# EAGLE design danger (EAGLE 6.4)
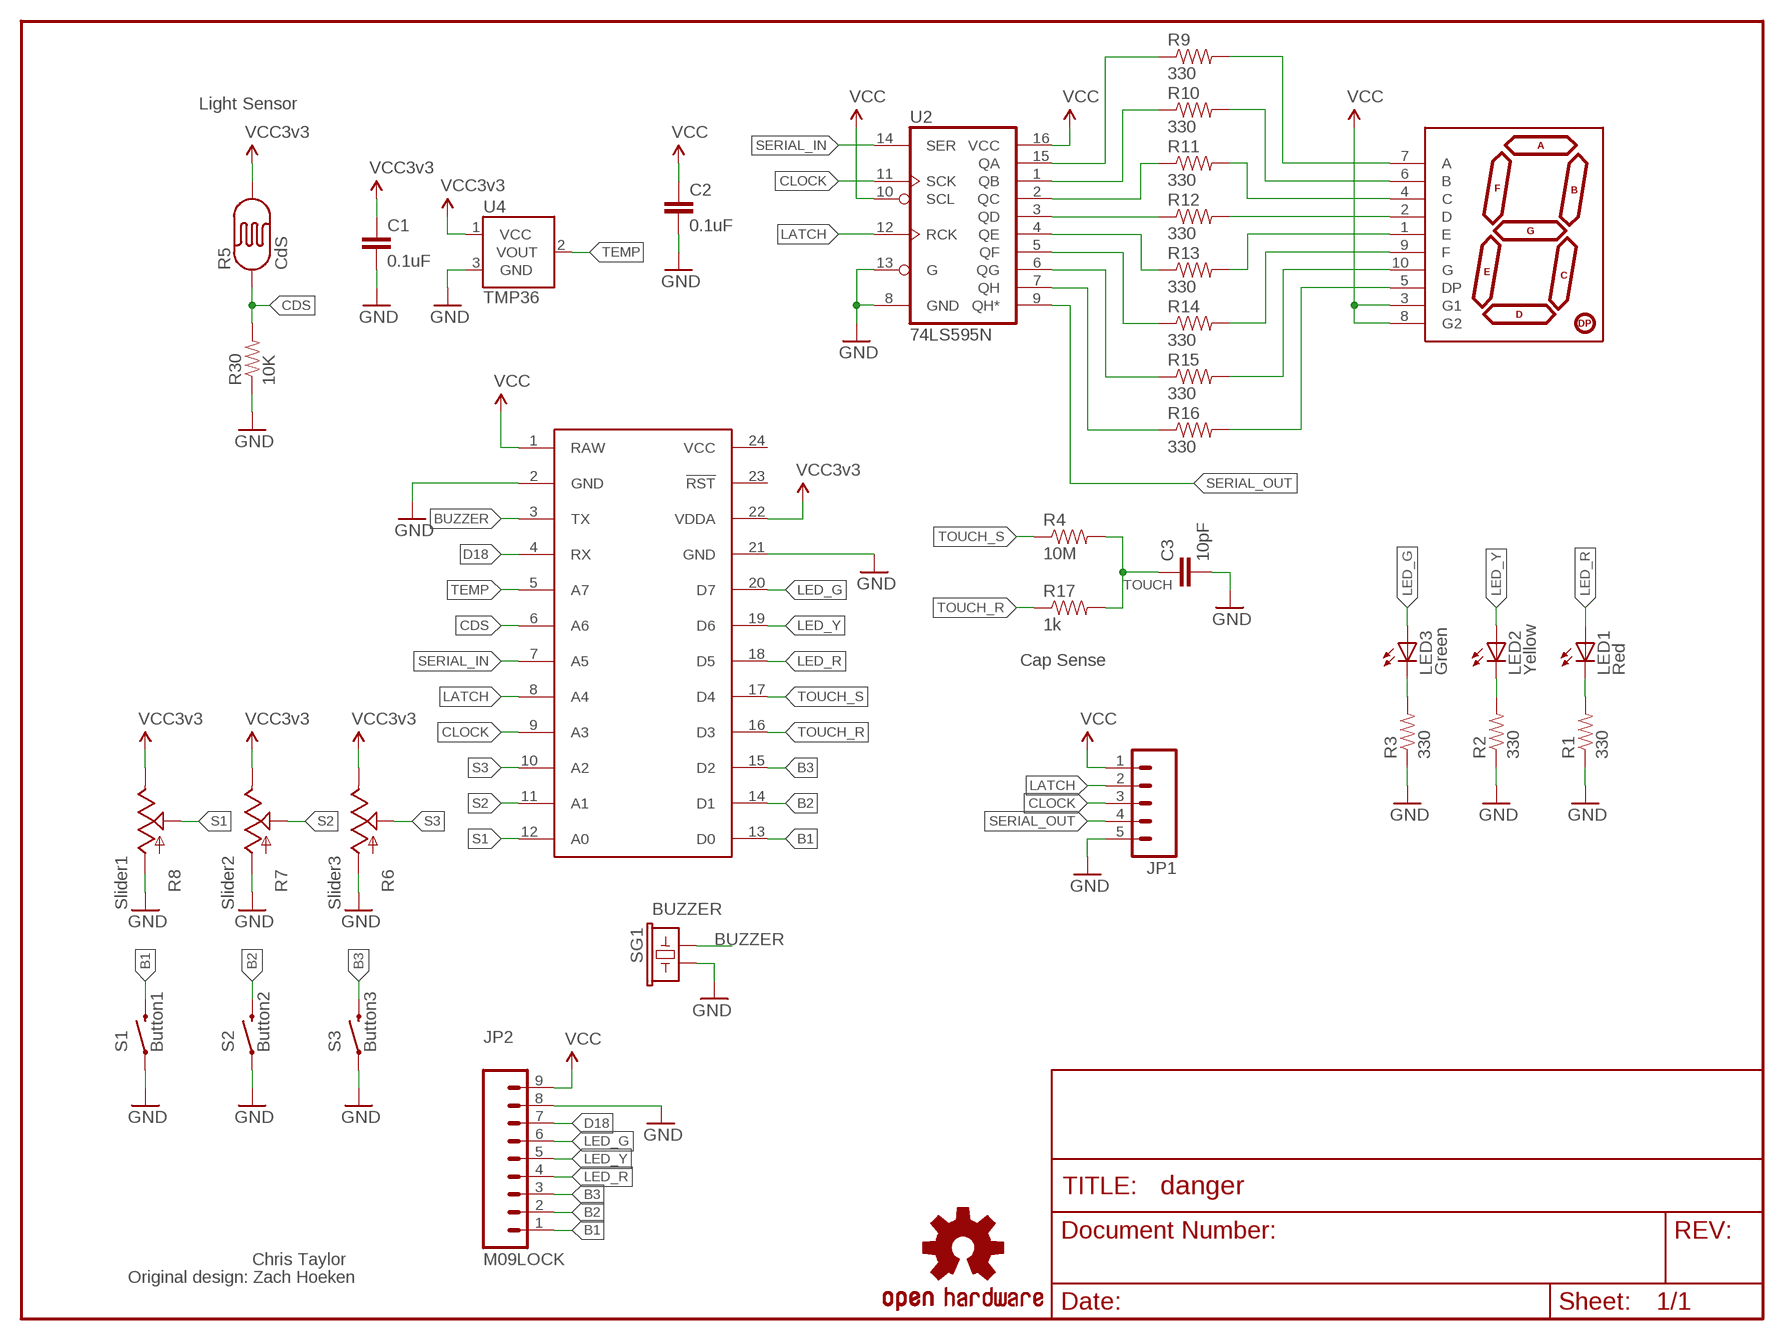
[diagram p0: schematic, sheet 1]

## Parts
C1  0.1uF  CAPPTH2  [CAP-PTH-SMALL2]
C2  0.1uF  CAPPTH2  [CAP-PTH-SMALL2]
C3  10pF  CAPPTH2  [CAP-PTH-SMALL2]
IC1  SPARK_CORECORE  [SPARK_CORE]
JP1  M05PTH  [1X05]
JP2  M09LOCK  [1X09_LOCK]
LED1  Red  LED5MM  [LED5MM]
LED2  Yellow  LED5MM  [LED5MM]
LED3  Green  LED5MM  [LED5MM]
R1  330  RESISTORAXIAL-0.3  [AXIAL-0.3]
R2  330  RESISTORAXIAL-0.3  [AXIAL-0.3]
R3  330  RESISTORAXIAL-0.3  [AXIAL-0.3]
R4  10M  RESISTORAXIAL-0.3  [AXIAL-0.3]
R5  CdS  PHOTOCELLPTH  [PHOTOCELL]
R6  Slider3  SLIDER  [SLIDER]
R7  Slider2  SLIDER  [SLIDER]
R8  Slider1  SLIDER  [SLIDER]
R9  330  RESISTORAXIAL-0.3  [AXIAL-0.3]
R10  330  RESISTORAXIAL-0.3  [AXIAL-0.3]
R11  330  RESISTORAXIAL-0.3  [AXIAL-0.3]
R12  330  RESISTORAXIAL-0.3  [AXIAL-0.3]
R13  330  RESISTORAXIAL-0.3  [AXIAL-0.3]
R14  330  RESISTORAXIAL-0.3  [AXIAL-0.3]
R15  330  RESISTORAXIAL-0.3  [AXIAL-0.3]
R16  330  RESISTORAXIAL-0.3  [AXIAL-0.3]
R17  1k  RESISTORAXIAL-0.3  [AXIAL-0.3]
R30  10K  RESISTORAXIAL-0.3  [AXIAL-0.3]
S1  Button1  SWITCH-MOMENTARY-212MM  [TACTILE-PTH-12MM]
S2  Button2  SWITCH-MOMENTARY-212MM  [TACTILE-PTH-12MM]
S3  Button3  SWITCH-MOMENTARY-212MM  [TACTILE-PTH-12MM]
SG1  BUZZER  BUZZERPTH  [BUZZER-12MM]
U2  74LS595N  [DIL16]
U4  TMP36  TMP36GT9  [TO-92]
U6  7-SEGMENT-DISPLAY-1"-RED  [7-SEGMENT-1"PTH]
U$2  OSHW-LOGOM  [OSHW-LOGO-M]

## Nets
B1: IC1.13(D0) JP2.1 S1.3
B2: IC1.14(D1) JP2.2 S2.3
B3: IC1.15(D2) JP2.3 S3.3
BUZZER: IC1.3(TX) SG1.+
CDS: IC1.6(A6) R5.1 R30.P$2
CLOCK: IC1.9(A3) JP1.3 U2.11(SCK)
D18: IC1.4(RX) JP2.7
GND: C1.2 C2.2 C3.2 IC1.2(GND) IC1.21(GND) JP1.5 JP2.8 R1.P$1 R2.P$1 R3.P$1 R6.3(A) R7.3(A) R8.3(A) R30.P$1 S1.1 S2.1 S3.1 SG1.- U2.8(GND) U2.13(G) U4.3(GND)
LATCH: IC1.8(A4) JP1.2 U2.12(RCK)
LED_G: IC1.20(D7) JP2.6 LED3.A
LED_R: IC1.18(D5) JP2.4 LED1.A
LED_Y: IC1.19(D6) JP2.5 LED2.A
N$2: R9.P$1 U2.15(QA)
N$3: LED1.K(C) R1.P$2
N$4: R10.P$1 U2.1(QB)
N$5: R11.P$1 U2.2(QC)
N$6: R12.P$1 U2.3(QD)
N$7: R13.P$1 U2.4(QE)
N$8: R14.P$1 U2.5(QF)
N$9: R15.P$1 U2.6(QG)
N$10: R16.P$1 U2.7(QH)
N$11: R9.P$2 U6.7(A)
N$12: R10.P$2 U6.6(B)
N$13: R11.P$2 U6.4(C)
N$14: R12.P$2 U6.2(D)
N$15: R13.P$2 U6.1(E)
N$16: R14.P$2 U6.9(F)
N$17: R15.P$2 U6.10(G)
N$18: R16.P$2 U6.5(DP)
N$19: LED2.K(C) R2.P$2
N$20: LED3.K(C) R3.P$2
S1: IC1.12(A0) R8.2A(S)
S2: IC1.11(A1) R7.2A(S)
S3: IC1.10(A2) R6.2A(S)
SERIAL_IN: IC1.7(A5) U2.14(SER)
SERIAL_OUT: JP1.4 U2.9(QH*)
TEMP: IC1.5(A7) U4.2(VOUT)
TOUCH: C3.1 R4.P$2 R17.P$2
TOUCH_R: IC1.16(D3) R17.P$1
TOUCH_S: IC1.17(D4) R4.P$1
VCC: C2.1 IC1.1(RAW) JP1.1 JP2.9 U2.10(SCL) U2.16(VCC) U6.3(G1) U6.8(G2)
VCC3V3: C1.1 IC1.22(VDDA) R5.2 R6.1(E) R7.1(E) R8.1(E) U4.1(VCC) ; supply symbol labelled VCC3v3
Unconnected: IC1.23(!RST)

## Notes on the sheet
- Light Sensor
- Cap Sense
- Chris Taylor
- Original design: Zach Hoeken

## Power pins joined to a net without a drawn wire
VCC: IC1.24(VCC)

## Library data of the parts
C1-C3 = SparkFun-Passives:CAP: Capacitor Standard 0603 ceramic capacitor, and 0.1" leaded capacitor.
IC1 = Spark:SPARK_CORE
JP1 = SparkFun:M05: Header 5 Standard 5-pin 0.1" header. Use with straight break away headers (SKU : PRT-00116), right angle break away headers (PRT-00553), swiss pins (PRT-00743), machine pins (PRT-00117), and female headers (PRT-00115). Molex polarized connector foot print use with SKU : PRT-08230 with associated crimp pins and housings.
JP2 = SparkFun-Connectors:M09: Header 9 Standard 9-pin 0.1" header. Use with straight break away headers (SKU : PRT-00116), right angle break away headers (PRT-00553), swiss pins (PRT-00743), machine pins (PRT-00117), and female headers (PRT-00115).
LED1-LED3 = SparkFun:LED: LEDs Standard schematic elements and footprints for 5mm, 3mm, 1206, and 0603 sized LEDs. 5mm - Spark Fun Electronics SKU : COM-00529 (and others)
R1-R4 R9-R17 R30 = SparkFun:RESISTOR: Resistor Basic schematic elements and footprints for 0603, 1206, and PTH resistors.
R5 = SparkFun:PHOTOCELL: Photocell Also known as a CdS photoresistor. This is a low cost way to detect light levels. Resistance decreases with more incoming light. SparkFun SKU: SEN-09088
R6-R8 = SparkFun:SLIDER
S1-S3 = SparkFun:SWITCH-MOMENTARY-2
SG1 = SparkFun:BUZZER: Buzzer 12mm Spark Fun Electronics SKU : Comp-Buzzer
U2 = SparkFun:74*595: 8-bit SHIFT REGISTER, output latch
U4 = SparkFun-Sensors:TMP36: Precision degC temp sensor, analog out
U6 = SparkFun:7-SEGMENT-DISPLAY-1"-RED: 7-Segment Display 1" Red (COM-08546)
U$2 = SparkFun-Aesthetics:OSHW-LOGO: Open Source Hardware Logo This logo indicates the piece of hardware it is found on incorporates a OSHW license and/or adheres to the definition of open source hardware found here: http://freedomdefined.org/OSHW

## Board
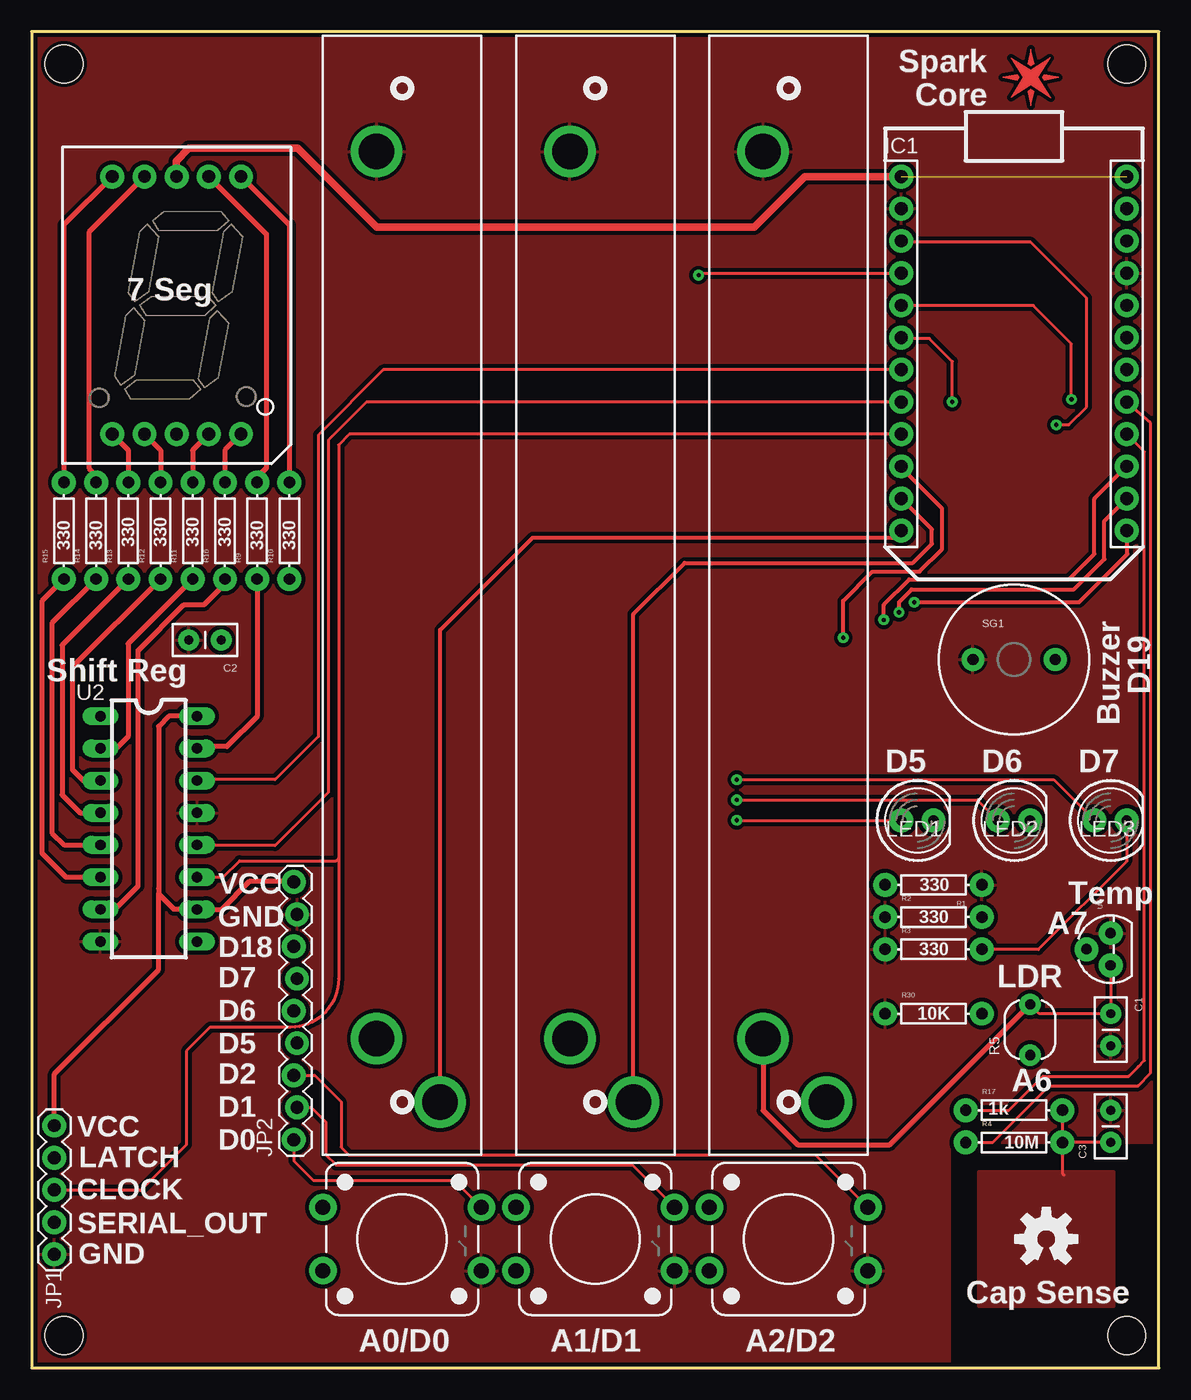
[diagram p1: board, top side]
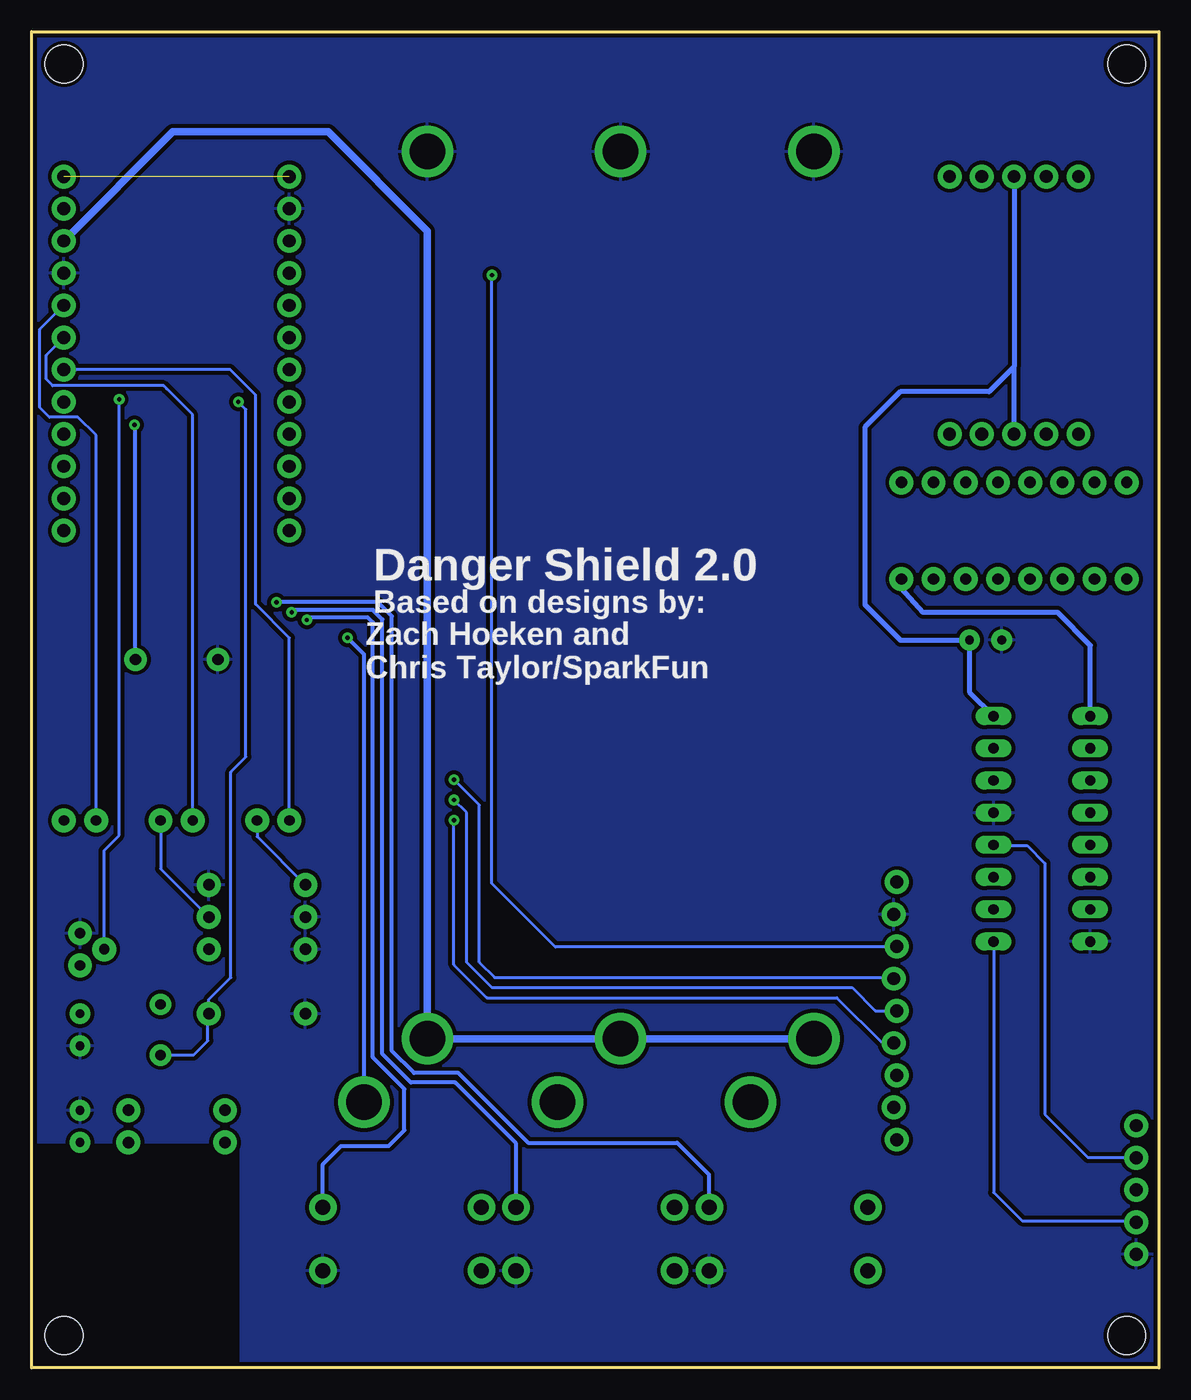
[diagram p2: board, bottom side, seen from below]

Size 88.9 x 105.41 mm. Coordinates in mm from the lower left corner, seen from the top.
Outline: 0,0 88.9,0 88.9,105.41 0,105.41 0,0
Copper layers (1*16): Top 0.035mm / dielectric 1.5mm / Bottom 0.035mm
Design rules "default": minimum track width 8mil, minimum drill 20mil, track to track 8mil, track to pad 8mil, pad to pad 8mil, via to via 8mil, smd to smd 8mil, copper to edge 8mil, drill to drill 8mil, minimum pad ring 12mil, minimum via ring 10mil, stop-mask expansion 4mil, vias tented up to drill 20mil, thermal gap 10mil
Holes 3 mm at 2.54,102.87 86.36,102.87 2.54,2.54 86.36,2.54

### Footprints (pad centres in the part's own frame; a part is rotated, then mirrored left to right if it is on the bottom)
CAP-PTH-SMALL2 = drill 0.7 pad 1.651: 1 0,0; 2 2.54,0
SPARK_CORE = drill 1.016 pad 1.88: 1 -8.89,13.97; 2 -8.89,11.43; 3 -8.89,8.89; 4 -8.89,6.35; 5 -8.89,3.81; 6 -8.89,1.27; 7 -8.89,-1.27; 8 -8.89,-3.81; 9 -8.89,-6.35; 10 -8.89,-8.89; 11 -8.89,-11.43; 12 -8.89,-13.97; 13 8.89,-13.97; 14 8.89,-11.43; 15 8.89,-8.89; 16 8.89,-6.35; 17 8.89,-3.81; 18 8.89,-1.27; 19 8.89,1.27; 20 8.89,3.81; 21 8.89,6.35; 22 8.89,8.89; 23 8.89,11.43; 24 8.89,13.97
1X05 = drill 1.016 pad 1.88: 1 0,0; 2 2.54,0; 3 5.08,0; 4 7.62,0; 5 10.16,0
1X09_LOCK = drill 1.016 pad 1.88: 1 0,0.127; 2 2.54,-0.127; 3 5.08,0.127; 4 7.62,-0.127; 5 10.16,0.127; 6 12.7,-0.127; 7 15.24,0.127; 8 17.78,-0.127; 9 20.32,0.127
LED5MM = drill 0.813 pad 1.88: A -1.27,0; K 1.27,0
AXIAL-0.3 = drill 0.9 pad 1.88: P$1 -3.81,0; P$2 3.81,0
PHOTOCELL = drill 0.8 pad 1.676: 1 -2,0; 2 2,0
SLIDER = drill 2.8 pad 4.064: 1 -35,2; 2A -40,-3; 3 35,2
TACTILE-PTH-12MM = drill 1.2 pad 2.159: 1 6.25,-2.5; 2 -6.25,-2.5; 3 6.25,2.5; 4 -6.25,2.5
BUZZER-12MM = drill 0.9 pad 1.778: + 3.25,0; - -3.25,0
DIL16 = drill 0.813 long: 1 -8.89,-3.81; 2 -6.35,-3.81; 3 -3.81,-3.81; 4 -1.27,-3.81; 5 1.27,-3.81; 6 3.81,-3.81; 7 6.35,-3.81; 8 8.89,-3.81; 9 8.89,3.81; 10 6.35,3.81; 11 3.81,3.81; 12 1.27,3.81; 13 -1.27,3.81; 14 -3.81,3.81; 15 -6.35,3.81; 16 -8.89,3.81
TO-92 = drill 0.813 pad 1.88: 1 -1.27,0; 2 0,1.905; 3 1.27,0
7-SEGMENT-1"PTH = drill 1 pad 1.88: 1 -5.08,-10.16; 2 -2.54,-10.16; 3 0,-10.16; 4 2.54,-10.16; 5 5.08,-10.16; 6 5.08,10.16; 7 2.54,10.16; 8 0,10.16; 9 -2.54,10.16; 10 -5.08,10.16

### Placement (x,y rotation side)
C1  85.09,27.94 270 top
C2  14.94,57.42 180 top
C3  85.09,17.78 90 top
IC1  77.47,80.01 0 top
JP1  1.79,19.11 270 top
JP2  20.8,18 90 top
LED1  69.85,43.18 0 top
LED2  77.47,43.18 0 top
LED3  85.09,43.18 0 top
R1  71.12,38.1 180 top
R2  71.12,35.56 0 top
R3  71.12,33.02 0 top
R4  77.47,17.78 0 top
R5  78.74,26.67 90 top
R6  59.69,60.96 90 top
R7  44.45,60.96 90 top
R8  29.21,60.96 90 top
R9  17.78,66.04 90 top
R10  20.32,66.04 90 top
R11  12.7,66.04 90 top
R12  10.16,66.04 90 top
R13  7.62,66.04 90 top
R14  5.08,66.04 90 top
R15  2.54,66.04 90 top
R16  15.24,66.04 90 top
R17  77.47,20.32 0 top
R30  71.12,27.94 0 top
S1  29.21,10.16 0 top
S2  44.45,10.16 0 top
S3  59.69,10.16 0 top
SG1  77.47,55.88 0 top
U2  9.23,42.52 270 top
U4  85.09,33.02 90 top
U6  11.43,83.82 0 top
U$1  [SPARK_LOGO_PLUS_PLANE]  78.8,101.8 0 top
U$2  80.01,10.16 0 top

### Tracks (layer width: path | path; a pad name or v marks a point on that pad's centre or on a via)
B1  (via drill 0.33)
  Top 0.254: JP2.1 20.67,16.33 22.2,14.8 33.32,14.8 S1.3
  Top 0.305: v69.6,60.4 82.6,60.4 86.4,64.2 86.4,66 IC1.13
  Bottom 0.305: S1.3 35.5,12.7 35.5,15.25 38,17.75 49.75,17.75 55.25,23.25 58.75,23.25 60.5,25 60.5,59.3 61.6,60.4 v69.6,60.4
B2  (via drill 0.33)
  Top 0.254: JP2.2 22.06,20.54 23.2,19.4 23.2,16.8 24,16 47.36,16 S2.3
  Top 0.305: v68.4,59.6 68.4,60.4 69.4,61.4 82.2,61.4 84.6,63.8 84.6,66.82 IC1.14
  Bottom 0.305: S2.3 50.7,17.7 55.5,22.5 59,22.5 61.25,24.75 61.25,59.05 62,59.8 68.2,59.8 v68.4,59.6
B3  (via drill 0.33)
  Top 0.254: JP2.3 22.32,23.08 24.4,21 24.4,17.4 25,16.8 61.8,16.8 S3.3
  Top 0.305: v67.2,59 67.2,60.2 69.2,62.2 81.8,62.2 83.8,64.2 83.8,68.56 IC1.15
  Bottom 0.305: S3.3 65.94,16.06 64.5,17.5 60.75,17.5 59.5,18.75 59.5,22 62,24.5 62,58.8 62.4,59.2 67,59.2 v67.2,59
BUZZER  (via drill 0.33)
  Top 0.254: v80.8,74.4 81.8,74.4 83.2,75.8 83.2,84.4 78.8,88.8 68.68,88.8 IC1.3
  Bottom 0.305: SG1.+ 80.72,74.32 v80.8,74.4
CDS  (via drill 0.33)
  Top 0.254: v72.6,76.2 72.6,79.4 70.8,81.2 68.66,81.2 IC1.6
  Bottom 0.254: v72.6,76.2 72,75.6 72,48.2 73.2,47 73.2,30.8 74.93,29.07 R30.P$2 75,27.87 75,25.8 76.13,24.67 R5.1
CLOCK
  Top 0.254: IC1.9 25.06,73.66 24.2,72.8 24.2,40.2 | 24.2,40.2 24.2,30.7 arc-90 20.4,26.86 14.06,26.86 12.2,25 12.2,17.6 8.6,14 1.82,14 JP1.3 | U2.11 15.11,38.71 16.4,40 24,40 24.2,40.2
D18  (via drill 0.33)
  Top 0.254: v52.6,86.2 52.76,86.36 IC1.4
  Bottom 0.254: JP2.7 20.71,33.2 47.6,33.2 52.6,38.2 v52.6,86.2
GND
  pour Top (isolate 0.305, rank 3): 0,105.41 0,0 72.39,0 72.39,17.78 88.9,17.78 88.9,105.41
  pour Bottom (isolate 0.305, rank 2): 0,105.41 0,0 72.39,0 72.39,17.78 88.9,17.78 88.9,105.41
LATCH  (via drill 0.33)
  Top 0.254: IC1.8 26.4,76.2 23.4,73.2 23.4,45.4 19.2,41.2 v13.09,41.2 U2.12
  Bottom 0.254: v13.09,41.2 10.4,41.2 9,39.8 9,20 5.6,16.6 1.82,16.6 JP1.2
LED_G  (via drill 0.33)
  Top 0.254: v55.6,46.4 80.6,46.4 LED3.A
  Bottom 0.254: LED3.A 83.82,73.57 85.25,75 87.5,75 88.25,75.75 88.25,81.93 IC1.20 | v55.6,46.4 53.6,44.4 53.6,32 52.4,30.8 21.03,30.8 JP2.6
LED_R  (via drill 0.33)
  Top 0.254: v55.6,43.2 68.56,43.2 LED1.A
  Bottom 0.254: LED1.A 68.58,57.58 71.25,60.25 71.25,76.75 73.25,78.75 IC1.18 | v55.6,43.2 55.6,31.8 53,29.2 25.4,29.2 21.82,25.62 JP2.4
LED_Y  (via drill 0.33)
  Top 0.254: v55.6,44.8 74.58,44.8 LED2.A
  Bottom 0.254: LED2.A 76.2,75.2 78.25,77.25 78.5,77.47 87.25,77.47 87.75,78 87.75,79.89 IC1.19 | v55.6,44.8 54.6,43.8 54.6,32 52.6,30 24.2,30 22.36,28.16 JP2.5
N$2
  Top 0.406: R9.P$1 17.78,51.38 15.4,49 13.17,49 U2.15
N$3
  Bottom 0.254: LED1.K 71.12,41.91 R1.P$2
N$4
  Bottom 0.406: U2.1 5.4,51.43 5.4,57 8,59.6 18.6,59.6 20.32,61.52 R10.P$1
N$5
  Top 0.406: R11.P$1 7.6,57.13 7.6,49.8 6.67,48.87 U2.2
N$6
  Top 0.406: R12.P$1 3.2,55.27 3.2,47.2 4.07,46.33 U2.3
N$7
  Top 0.406: R13.P$1 2.4,57.01 2.4,45.2 3.81,43.79 U2.4
N$8
  Top 0.406: R14.P$1 1.6,58.75 1.6,42.2 2.55,41.25 U2.5
N$9
  Top 0.406: R15.P$1 0.8,60.49 0.8,40.6 2.69,38.71 U2.6
N$10
  Top 0.406: U2.7 5.45,36.2 6.6,36.2 8.4,38 8.4,56.6 12,60.2 13.6,60.2 15.24,61.84 R16.P$1
N$11
  Top 0.406: U6.7 18.5,89.45 18.5,71 17.78,70.28 R9.P$2
N$12
  Top 0.406: U6.6 20.32,90.17 R10.P$2
N$13
  Top 0.406: U6.4 12.7,72.39 R11.P$2
N$14
  Top 0.406: U6.2 10.16,72.39 R12.P$2
N$15
  Top 0.406: U6.1 7.62,72.39 R13.P$2
N$16
  Top 0.406: U6.9 4.5,89.59 4.5,71 5.08,70.42 R14.P$2
N$17
  Top 0.406: U6.10 2.54,90.17 R15.P$2
N$18
  Top 0.406: U6.5 15.24,72.39 R16.P$2
N$19
  Bottom 0.254: LED2.K 78.74,39.37 R2.P$2
N$20
  Top 0.254: LED3.K 86.36,39.96 79.4,33 74.95,33 R3.P$2
S1
  Top 0.305: R8.2A 32.21,58.21 39.5,65.5 68.04,65.5 IC1.12
S2
  Top 0.305: R7.2A 47.45,59.45 51.5,63.5 69.5,63.5 71,65 71,66.16 IC1.11
S3  (via drill 0.33)
  Top 0.305: IC1.10 68.58,71.02 71.8,67.8 71.8,64.6 70,62.8 66.3,62.8 64,60.5 v64,57.6
  Bottom 0.305: R6.2A 62.69,56.29 v64,57.6
SERIAL_IN
  Top 0.254: IC1.7 27.74,78.74 22.6,73.6 22.6,49.8 19.2,46.4 13.11,46.4 U2.14
SERIAL_OUT
  Bottom 0.254: U2.9 13.04,13.84 10.8,11.6 1.9,11.6 JP1.4
TEMP  (via drill 0.33)
  Top 0.254: v82,76.4 82,80.8 79,83.8 68.6,83.8 IC1.5
  Bottom 0.254: U4.2 83.19,40.81 82,42 v82,76.4
TOUCH
  Top 0.254: R17.P$2 R4.P$2 | R4.P$2 81.28,15.32 81.4,15.2 | C3.1 R4.P$2
  pour Top: 74.68,15.49 85.34,15.49 85.34,4.83 74.68,4.83
TOUCH_R
  Top 0.254: R17.P$1 77.07,20.32 79.75,23 86.5,23 87.25,23.75 87.75,24.25 87.75,72.27 IC1.16
TOUCH_S
  Top 0.254: R4.P$1 75.78,17.78 80.25,22.25 87.25,22.25 88.25,23.25 88.25,74.56 IC1.17
VCC  (1 unrouted)
  Top 0.406: U2.16 10.81,51.41 10,50.6 10,37.8 10,37.4 | 10,37.4 11.2,36.2 13.01,36.2 U2.10 14.97,36.17 17.2,38.4 20.59,38.4 JP2.9 | JP1.1 1.79,23.19 10,31.4 10,37.4
  Top 0.61: IC1.1 60.98,93.98 57,90 27.2,90 21,96.2 12.4,96.2 11.4,95.2 11.4,94.01 U6.8
  Bottom 0.406: U6.8 11.43,78.97 | 11.43,78.97 13.4,77 20.4,77 23.2,74.2 23.2,60.2 20.4,57.4 14.96,57.4 | U6.3 11.43,78.97 | 14.96,57.4 C2.1 | 14.96,57.4 14.96,53.33 U2.16
VCC3V3
  Top 0.254: R5.2 79.47,27.94 C1.1 U4.1
  Top 0.406: R6.1 57.69,20.31 60.4,17.6 67.67,17.6 R5.2
  Bottom 0.61: IC1.22 77.76,97.5 65.5,97.5 57.69,89.69 R6.1 R7.1 R8.1

### Text on the board
tPlace: Spark / Core | 7 Seg | Shift Reg | D19 | Buzzer | D5 | D6 | D7 | Temp | VCC | A7 | GND | D18 | LDR | D7 | D6 | D5 | A6 | D2 | D1 | VCC | D0 | LATCH | CLOCK | SERIAL_OUT | GND | Cap Sense | A0/D0 | A1/D1 | A2/D2
bPlace: Danger Shield 2.0 | Based on designs by: | Zach Hoeken and / Chris Taylor/SparkFun
Measures: 0 | 0 | 0 | 0